# Altium project MMB_Controller.PrjPcb (part 4 of 4)
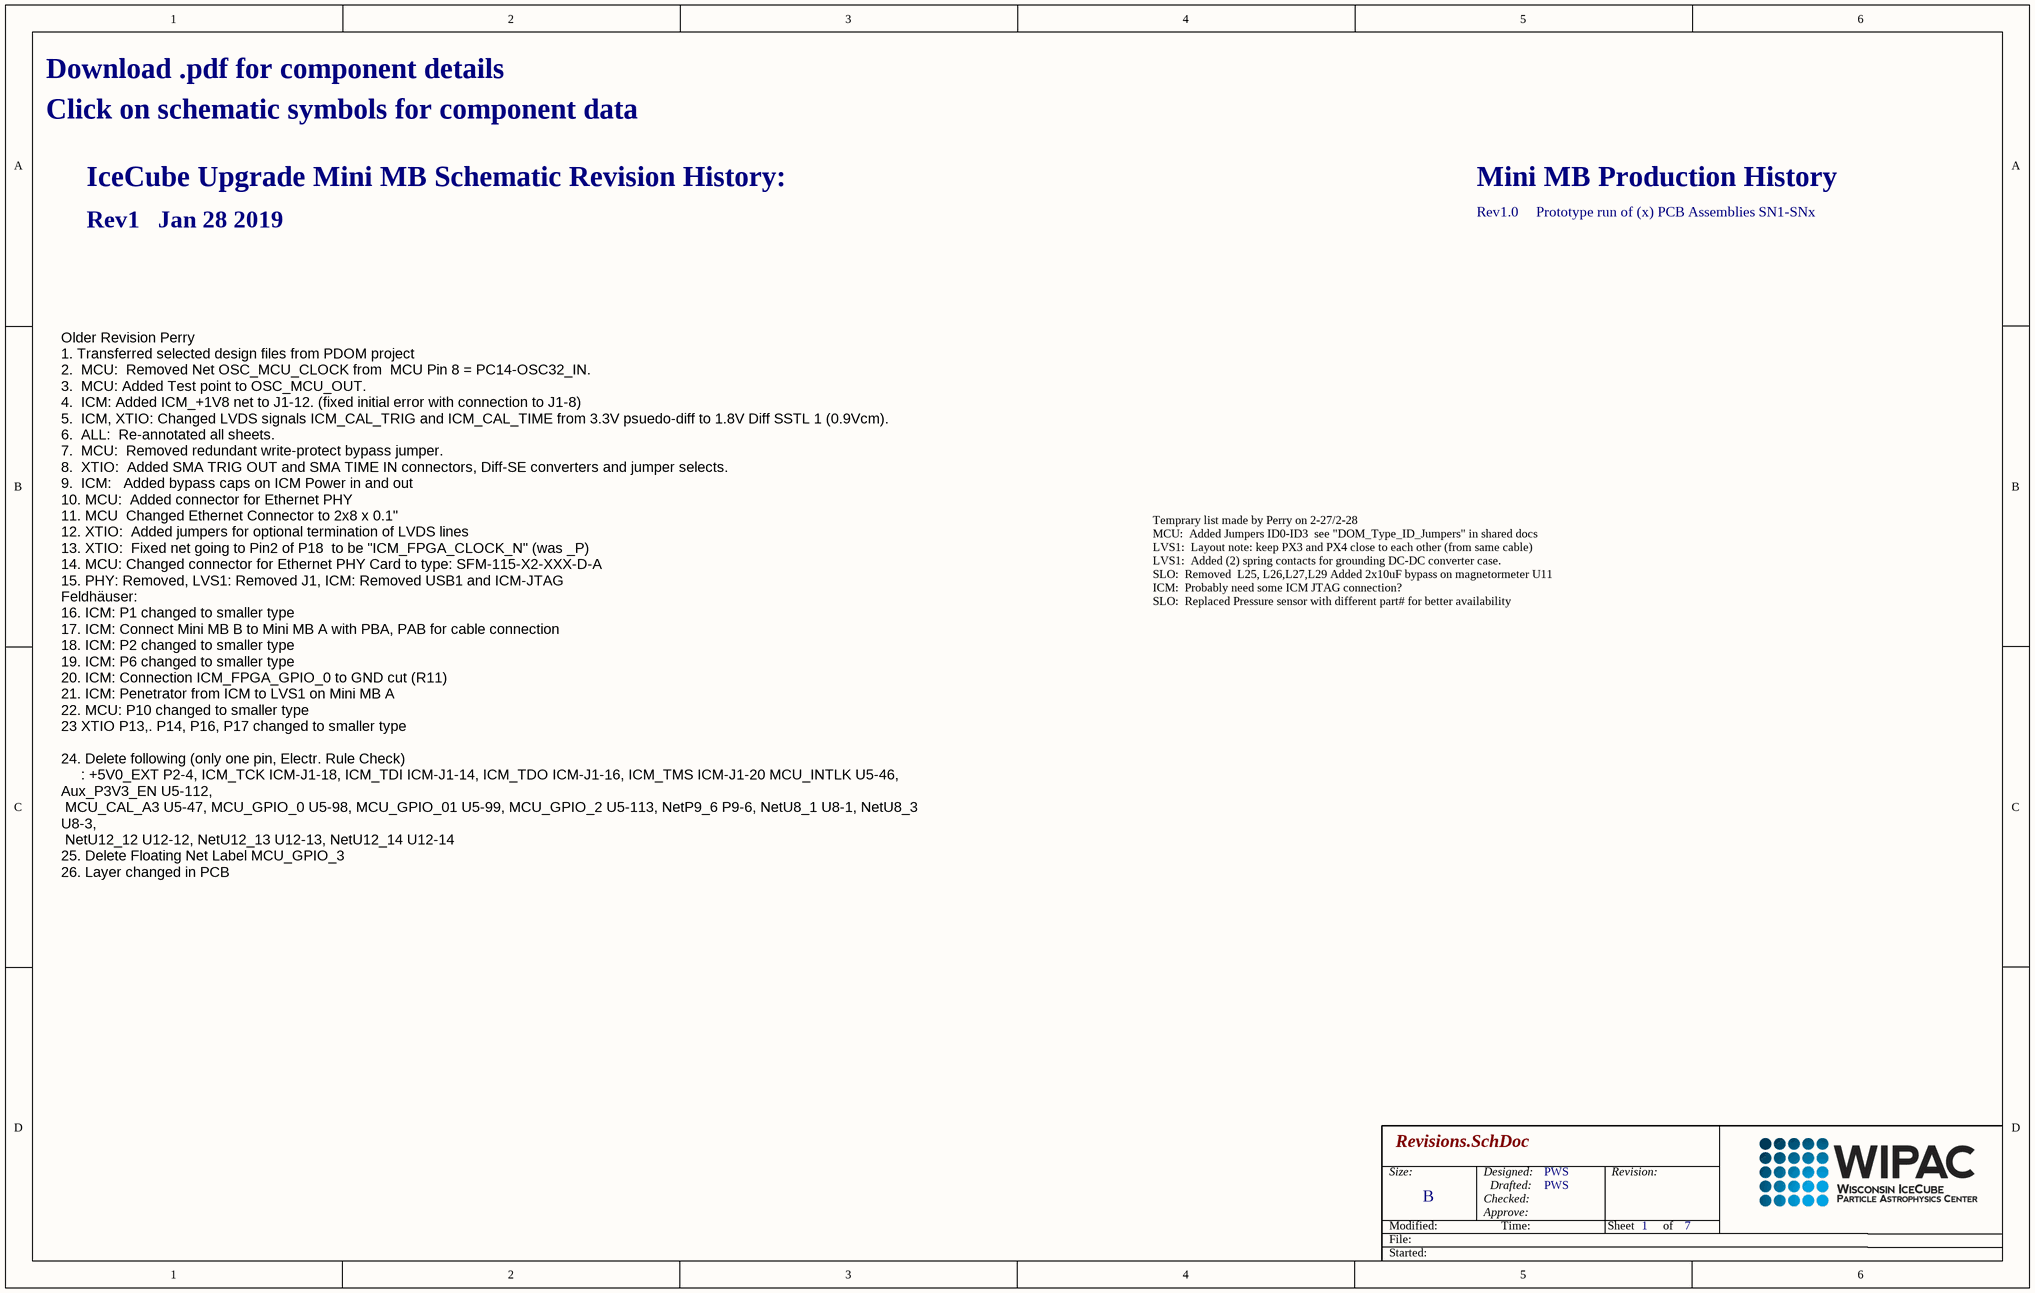
[diagram p6: Revisions.SchDoc]

## Nets that join several sheets
+1V8_A: PFIL (5 pins), SLO (L28.2)
+1V8_D: ICM (C2.2 C4.2 U1.1 U2.1), MCU (36 pins), PFIL (5 pins), SLO (18 pins), XTIO (C132.2 U17.1)
+3V3_A: MCU (5 pins), PFIL (5 pins)
+3V3_D: ICM (9 pins), MCU (9 pins), PFIL (5 pins), SLO (C96.2 C97.2 L27.2 U10.10), XTIO (16 pins)
+5V0: ICM (7 pins), XTIO (6 pins)
GND: ICM (46 pins), MCU (54 pins), PFIL (34 pins), SLO (30 pins), XTIO (78 pins)
ICM_+1V8: ICM (6 pins), PFIL (L13.1 L16.1), XTIO (6 pins)
ICM_+3V3: ICM (5 pins), PFIL (L19.1 L22.1), XTIO (6 pins)
ICM_CAL_TIME_N: ICM (ICM-J1.21), XTIO (P14.3 R74.2 U16.4)
ICM_CAL_TIME_P: ICM (ICM-J1.19), XTIO (P14.4 R73.1 U16.3)
ICM_CAL_TRIG_N: ICM (ICM-J1.17), XTIO (P13.3 R76.2 U15.4)
ICM_CAL_TRIG_P: ICM (ICM-J1.15), XTIO (P13.4 R75.1 U15.3)
ICM_FPGA_CLOCK_N: ICM (ICM-J2.3), MCU (U6.4), XTIO (P11.9 R78.2)
ICM_FPGA_CLOCK_P: ICM (ICM-J2.2), MCU (U6.3), XTIO (P11.10 R77.1)
ICM_FPGA_GPIO_0: ICM (ICM-J2.8 R11.2), XTIO (R40.1)
ICM_FPGA_GPIO_1: ICM (ICM-J2.9 R12.1), XTIO (R41.2)
ICM_FPGA_SYNC_N: ICM (ICM-J2.5), MCU (U9.4), XTIO (P11.12 R80.2)
ICM_FPGA_SYNC_P: ICM (ICM-J2.6), MCU (U9.3), XTIO (P11.13 R79.1)
ICM_MBPWR_EN: ICM (ICM-J2.23), XTIO (P11.19)
ICM_MCU_BOOT: ICM (ICM-J2.18), MCU (R31.1 U5.138)
ICM_MCU_nRST: ICM (ICM-J2.12), MCU (C49.2 R36.1 U5.25)
ICM_MCU_TIME_LV: MCU (U5.97), XTIO (U17.3)
ICM_MCU_TRIG_LV: MCU (U5.37), XTIO (U17.2)
ICM_MCU_USART_CK: ICM (ICM-J2.11), MCU (U5.100)
ICM_MCU_USART_CTS: ICM (ICM-J2.22), MCU (U5.103)
ICM_MCU_USART_RTS: ICM (ICM-J2.21), MCU (U5.104)
ICM_MCU_USART_RX: ICM (ICM-J2.20), MCU (U5.76)
ICM_MCU_USART_TX: ICM (ICM-J2.19), MCU (U5.75)
INTLK_0: ICM (ICM-J2.24 R1.2 R2.2 U1.7), XTIO (P11.20)
INTLK_0_LV: ICM (U1.2), MCU (R24.1 R27.2 U4.9)
INTLK_1: ICM (ICM-J2.25 R3.2 R5.2 U1.6), XTIO (P11.21)
INTLK_1_LV: ICM (U1.3), MCU (R28.2)
INTLK_2: ICM (ICM-J2.26 R4.2 R7.2 U2.7), XTIO (P11.22)
INTLK_2_LV: ICM (U2.2), MCU (R29.2)
INTLK_3: ICM (ICM-J2.27 R6.2 R8.2 U2.6), XTIO (P11.23)
INTLK_3_LV: ICM (U2.3), MCU (R30.2)
MCU_GPIO_PA4: MCU (U5.40), XTIO (R72.2)
MCU_GPIO_PA9: MCU (U5.101), XTIO (R42.2)
MCU_GPIO_PB4: MCU (U5.134), XTIO (R46.2)
MCU_GPIO_PB8: MCU (U5.139), XTIO (R47.2)
MCU_GPIO_PB9: MCU (U5.140), XTIO (R48.2)
MCU_GPIO_PB10: MCU (U5.69), XTIO (R49.2)
MCU_GPIO_PC2: MCU (U5.28), XTIO (R44.2)
MCU_GPIO_PC3: MCU (U5.29), XTIO (R45.2)
MCU_GPIO_PE2: MCU (U5.1), XTIO (R50.2)
MCU_GPIO_PE4: MCU (U5.3), XTIO (R51.2)
MCU_GPIO_PE5: MCU (U5.4), XTIO (R52.2)
MCU_GPIO_PE6: MCU (U5.5), XTIO (R53.2)
MCU_GPIO_PE7: MCU (U5.58), XTIO (R54.2)
MCU_GPIO_PE8: MCU (U5.59), XTIO (R55.2)
MCU_GPIO_PE9: MCU (U5.60), XTIO (R56.2)
MCU_GPIO_PE10: MCU (U5.63), XTIO (R57.2)
MCU_GPIO_PF0: MCU (U5.10), XTIO (R58.2)
MCU_GPIO_PF1: MCU (U5.11), XTIO (R59.2)
MCU_GPIO_PF2: MCU (U5.12), XTIO (R60.2)
MCU_GPIO_PF3: MCU (U5.13), XTIO (R61.2)
MCU_GPIO_PF4: MCU (U5.14), XTIO (R62.2)
MCU_GPIO_PF5: MCU (U5.15), XTIO (R63.2)
MCU_GPIO_PF6: MCU (U5.18), XTIO (R64.2)
MCU_GPIO_PF7: MCU (U5.19), XTIO (R65.2)
MCU_GPIO_PF8: MCU (U5.20), XTIO (R66.2)
MCU_GPIO_PF9: MCU (U5.21), XTIO (R67.2)
MCU_GPIO_PF10: MCU (U5.22), XTIO (R68.2)
MCU_GPIO_PF11: MCU (U5.49), XTIO (R69.2)
MCU_GPIO_PF12: MCU (U5.50), XTIO (R70.2)
MCU_GPIO_PF13: MCU (U5.53), XTIO (R71.2)
PCA_ID: ICM (ICM-J2.28 U3.3), XTIO (P11.18)
SLO_I2C1_SCL: MCU (U5.136), SLO (R37.2 U10.2 U11.1)
SLO_I2C1_SDA: MCU (U5.137), SLO (R38.2 U10.4 U11.11)
SLO_I2C4_SCL: MCU (U5.81), SLO (R301.2 U12.1)
SLO_I2C4_SDA: MCU (U5.82), SLO (R302.2 U12.3)